# EAGLE design iridia-tam-left-board (EAGLE 6.4)
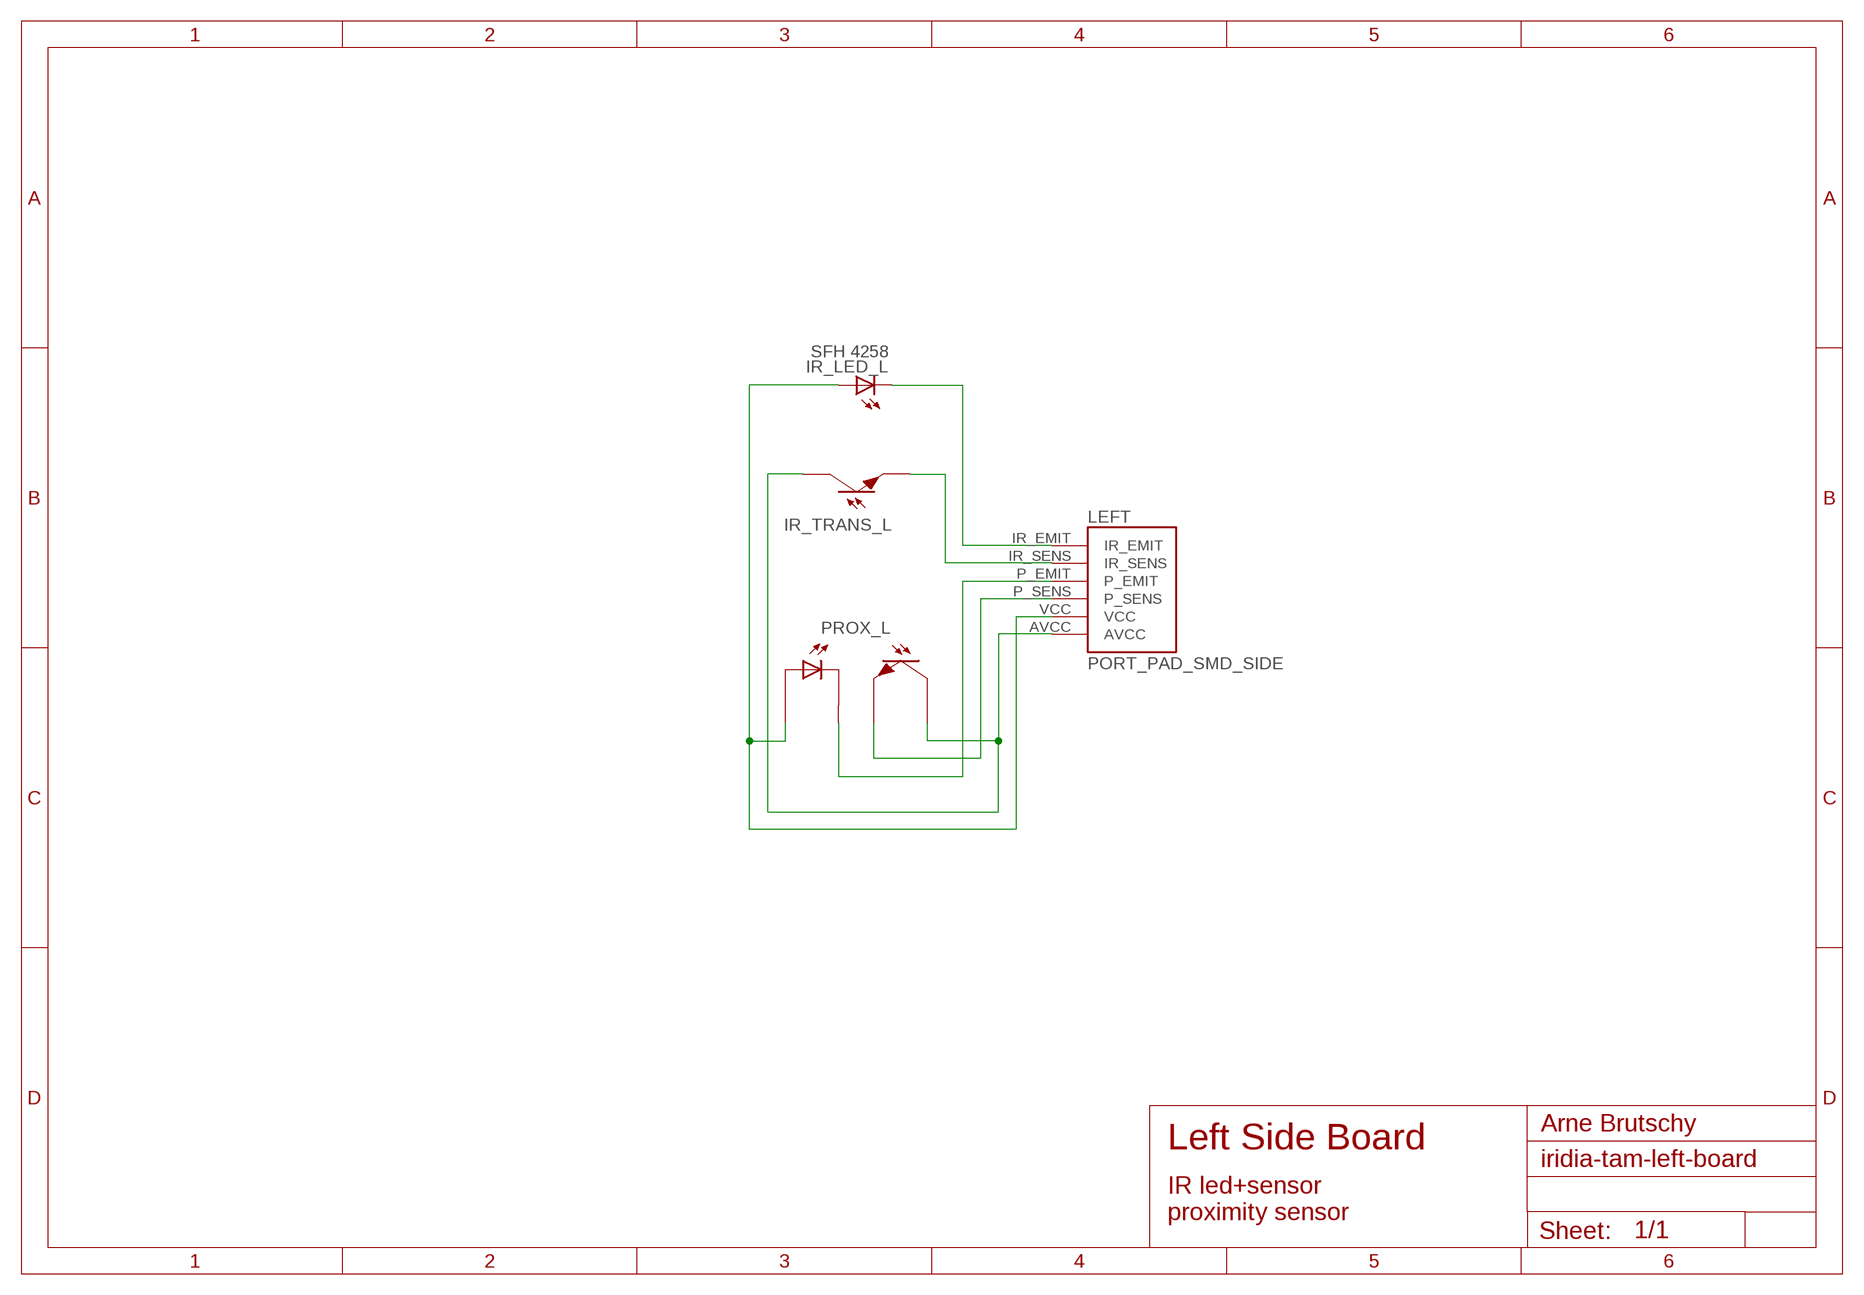
[diagram p0: schematic, sheet 1]

## Parts
IR_LED_L  SFH 4258  LEDP-LCC-4  [P-LCC-4-1C-3A]
IR_TRANS_L  SFH 320 FA  IR_TRANSP-LCC-2  [P-LCC-2-TRANS]
LEFT  PORT_PAD_SMD_SIDE  [PORT_PAD_SMD_SIDE]
PROX_L  TCRT1000  TCRT1000_TH  [TCRT1000_TH]

## Nets
AVCC: IR_TRANS_L.COL LEFT.AVCC PROX_L.COL
IR_EMIT_L: IR_LED_L.C@1(C) LEFT.IR_EMIT
IR_SENSE_L: IR_TRANS_L.E LEFT.IR_SENS
PROX_EMIT: LEFT.P_EMIT PROX_L.CAT
PROX_SENSE: LEFT.P_SENS PROX_L.E
VCC [power]: IR_LED_L.A@2(A) IR_LED_L.A@3(A) IR_LED_L.A@4(A) LEFT.VCC PROX_L.A

## Notes on the sheet
- Arne Brutschy
- Left Side Board
- IR led+sensor
  proximity sensor

## Library data of the parts
IR_LED_L = iridia:LED: LED OSRAM: - CHIPLED LG R971, LG N971, LY N971, LG Q971, LY Q971, LO R971, LY R971 LH N974, LH R974 LS Q976, LO Q976, LY Q976 LO Q996 - Hyper CHIPLED LW Q18S LB Q993, LB Q99A, LB R99A - SideLED LS A670, LO A670, LY A670, LG A670, LP A670 LB A673, LV A673, LT A673, LW A673 LH A674 LY A675 LS A676, LA A676, LO A676, LY A676, LW A676 LS A679, LY A679, LG A679 - Hyper Micro SIDELED® LS Y876, LA Y876, LO Y876, LY Y876 LT Y87S - SmartLED LW L88C, LW L88S LB L89C, LB L89S, LG L890 LS L89K, LO L89K, LY L89K LS L896, LA L896, LO L896, LY L896 - TOPLED LS T670, LO T670, LY T670, LG T670, LP T670 LSG T670, LSP T670, LSY T670, LOP T670, LYG T670 LG T671, LOG T671, LSG T671 LB T673, LV T673, LT T673, LW T673 LH T674 LS T676, LA T676, LO T676, LY T676, LB T676, LH T676, LSB T676, LW T676 LB T67C, LV T67C, LT T67C, LS T67K, LO T67K, LY T67K, LW E67C LS E67B, LA E67B, LO E67B, LY E67B, LB E67C, LV E67C, LT E67C LW T67C LS T679, LY T679, LG T679 LS T770, LO T770, LY T770, LG T770, LP T770 LB T773, LV T773, LT T773, LW T773 LH T774 LS E675, LA E675, LY E675, LS T675 LS T776, LA T776, LO T776, LY T776, LB T776 LHGB T686 LT T68C, LB T68C - Hyper Mini TOPLED® LB M676 - Mini TOPLED Santana® LG M470 LS M47K, LO M47K, LY M47K Source: http://www.osram.convergy.de LUXEON: - LUMILED® LXK2-PW12-R00, LXK2-PW12-S00, LXK2-PW14-U00, LXK2-PW14-V00 LXK2-PM12-R00, LXK2-PM12-S00, LXK2-PM14-U00 LXK2-PE12-Q00, LXK2-PE12-R00, LXK2-PE12-S00, LXK2-PE14-T00, LXK2-PE14-U00 LXK2-PB12-K00, LXK2-PB12-L00, LXK2-PB12-M00, LXK2-PB14-N00, LXK2-PB14-P00, LXK2-PB14-Q00 LXK2-PR12-L00, LXK2-PR12-M00, LXK2-PR14-Q00, LXK2-PR14-R00 LXK2-PD12-Q00, LXK2-PD12-R00, LXK2-PD12-S00 LXK2-PH12-R00, LXK2-PH12-S00 LXK2-PL12-P00, LXK2-PL12-Q00, LXK2-PL12-R00 Source: www.luxeon.com KINGBRIGHT: KA-3528ASYC Source: www.kingbright.com
IR_TRANS_L = iridia:IR_TRANS: IR TRANSITOR Package P-LCC-2 Osram SFH 320, SFH 320 FA
LEFT = iridia:PORT_PAD_SMD_SIDE: Connector pad for soldering side boards on side board of IRIDIA TAM
PROX_L = iridia:TCRT1000_TH

## Net classes
0 default: width 0.254 mm, drill 0.305 mm, clearance 0.152 mm
1 power: width 0.381 mm, clearance 0.254 mm
2 gnd: width 0.305 mm, drill 0.152 mm, clearance 0.152 mm
3 usbvcc: width 0.508 mm, drill 0.508 mm, clearance 0.152 mm
4 aref: width 0.406 mm

## Board
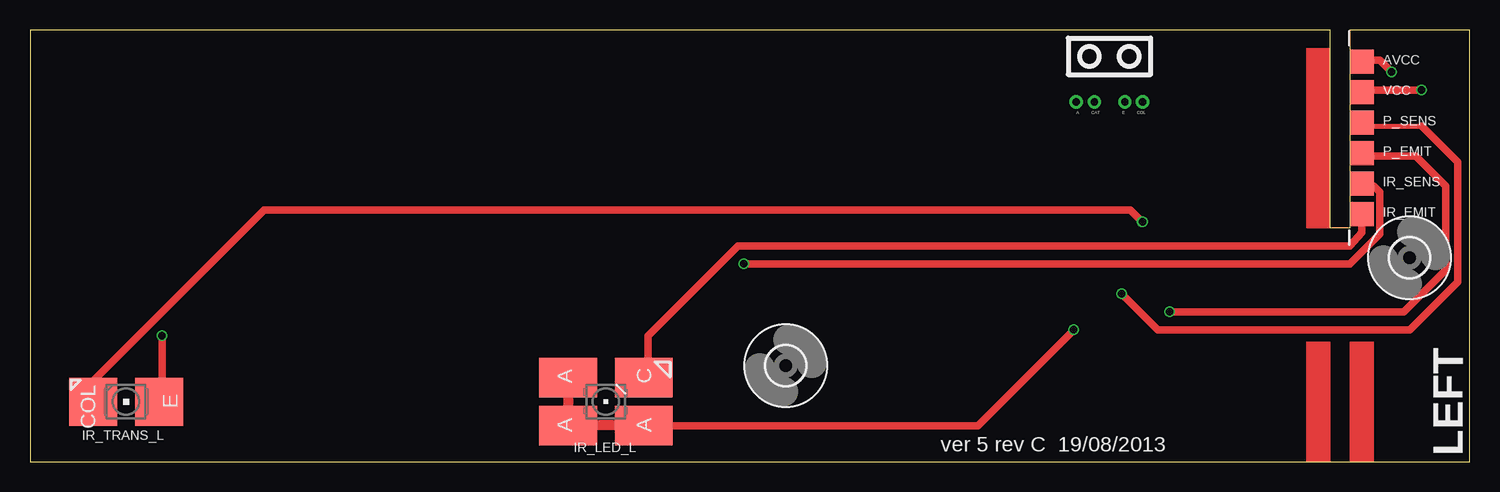
[diagram p1: board, top side]
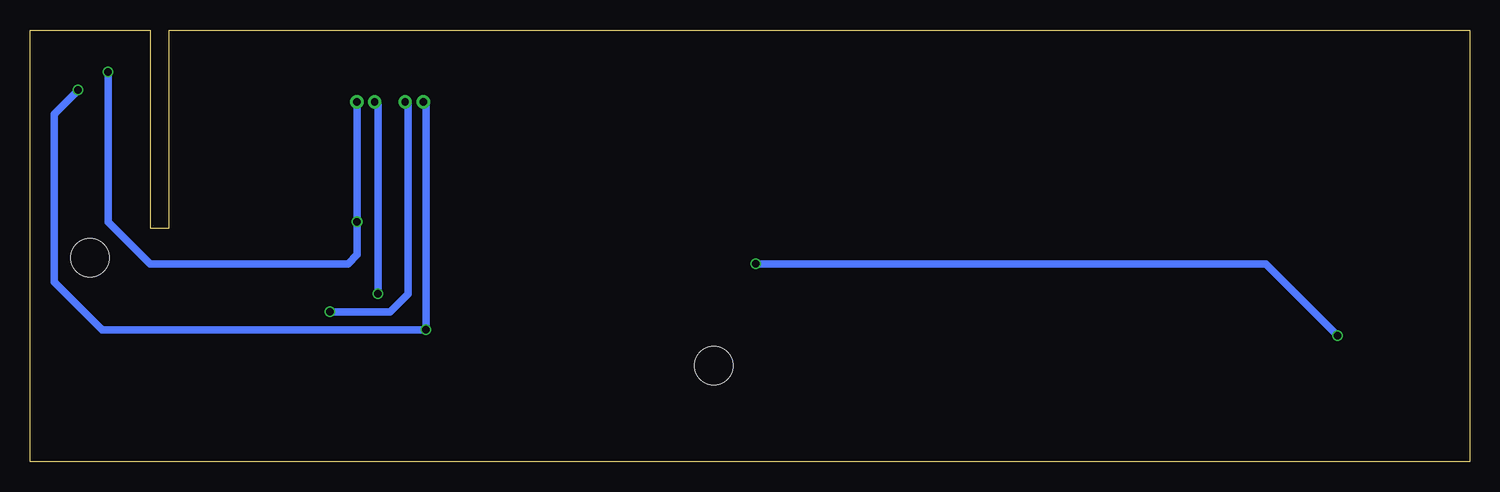
[diagram p2: board, bottom side, seen from below]

Size 120 x 36 mm. Coordinates in mm from the lower left corner, seen from the top.
Outline: 0,0 120,0 120,36 110,36 110,19.5 108.4,19.5 108.4,36 0,36 0,0
Copper layers (1*16): Top 0.035mm / dielectric 1.5mm / Bottom 0.035mm
Design rules "myropcb": minimum track width 4mil, minimum drill 6mil, track to track 4mil, track to pad 4mil, pad to pad 4mil, via to via 4mil, smd to smd 0mil, copper to edge 10mil, drill to drill 10mil, minimum pad ring 10mil, minimum via ring 6mil, stop-mask expansion 2mil, vias tented up to drill 100mil, thermal gap 10mil

### Footprints (pad centres in the part's own frame; a part is rotated, then mirrored left to right if it is on the bottom)
P-LCC-4-1C-3A = smd 3.3 x 4.8: A@2 -2,-3.15; A@3 -2,3.15; A@4 2,3.15; C@1 2,-3.15
P-LCC-2-TRANS = smd 4 x 4: COL 0,-2.75; E 0,2.75
PORT_PAD_SMD_SIDE = smd 2 x 2: AVCC 0,6.35; IR_EMIT 0,-6.35; IR_SENS 0,-3.81; P_EMIT 0,-1.27; P_SENS 0,1.27; VCC 0,3.81
TCRT1000_TH = drill 0.6 pad 1.067: A -2.794,0; CAT -1.27,0; COL 2.743,0; E 1.27,0
3,2 = hole 3.2: 0,0

### Placement (x,y rotation side)
IR_LED_L  48,5 90 top
IR_TRANS_L  8,5 270 top
LEFT  111,27 0 top
PROX_L  90,30 0 top
U$2  [3,2]  63,8 0 top
U$3  [3,2]  115,17 0 top

### Tracks (layer width: path | path; a pad name or v marks a point on that pad's centre or on a via)
AVCC  (via drill 0.6)
  Top 0.406: 111.15,33.5 LEFT.AVCC
  Top 0.61: v113.5,32.5 112.5,33.5 111.15,33.5 | IR_TRANS_L.COL 5.25,6.75 19.5,21 91.74,21 v92.74,20
  Bottom 0.61: PROX_L.COL v92.74,20 92.74,19 92.74,17.26 93.5,16.5 110,16.5 113.5,20 v113.5,32.5
IR_EMIT_L
  Top 0.406: 51.5,8 51.5,7.09 51.24,7.09 IR_LED_L.C@1
  Top 0.61: LEFT.IR_EMIT 111,19.12 110,18 59,18 51.5,10.5 51.5,8
IR_SENSE_L  (via drill 0.6)
  Top 0.406: 11,5.5 arc-60 10.86,5.11 IR_TRANS_L.E
  Top 0.61: LEFT.IR_SENS 112,23 112.5,22.5 112.5,19 110,16.5 v59.5,16.5 | v11,10.5 11,5.5
  Bottom 0.61: v59.5,16.5 17,16.5 v11,10.5
PROX_EMIT  (via drill 0.6)
  Top 0.406: LEFT.P_EMIT 111,25.5
  Top 0.61: 111,25.5 115.5,25.5 118,23 118,16 114.5,12.5 v95,12.5
  Top 0.813: 88.85,29.88 PROX_L.CAT
  Bottom 0.406: 88.5,29.85 88.58,29.85 PROX_L.CAT
  Bottom 0.61: v95,12.5 90,12.5 88.5,14 88.5,29.85
PROX_SENSE  (via drill 0.6)
  Top 0.406: LEFT.P_SENS 111.5,28.27 111.5,28 116,28
  Top 0.61: v91,14 94,11 115,11 119,15 119,25 116,28
  Bottom 0.406: 91,29.73 PROX_L.E
  Bottom 0.61: v91,14 91,29.73
VCC  (via drill 0.6)
  Top 0.61: IR_LED_L.A@2 79,3 v87,11 | v116,31 111.19,31 LEFT.VCC
  Top 0.813: IR_LED_L.A@3 44.89,3.05 | 44.89,3.05 51.1,3.05 IR_LED_L.A@2 | IR_LED_L.A@4 44.85,3.09 44.89,3.05 | 87.15,29.94 PROX_L.A
  Bottom 0.61: v116,31 118,29 118,15 114,11 v87,11 87,29.79 PROX_L.A
(copper drawn outside any net)
  shapes: Top area x3

### Text on the board
tPlace: ver 5 rev C 19/08/2013